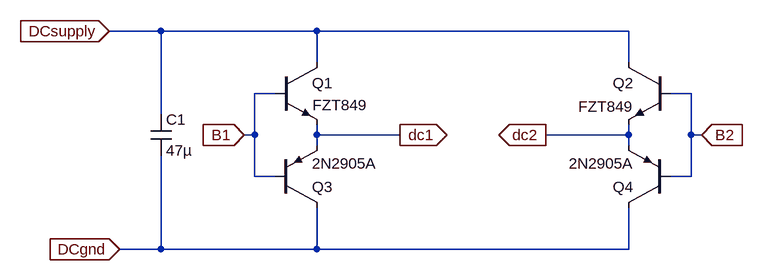
[diagram p0: schematic DCmotor_driver.asc]
DCmotor_driver.asc, the LTspice schematic file:
Version 4
SHEET 1 1004 680
WIRE 80 -32 0 -32
WIRE 320 -32 80 -32
WIRE 800 -32 320 -32
WIRE 320 16 320 -32
WIRE 800 16 800 -32
WIRE 256 64 224 64
WIRE 896 64 864 64
WIRE 80 96 80 -32
WIRE 224 128 224 64
WIRE 224 128 208 128
WIRE 320 128 320 112
WIRE 448 128 320 128
WIRE 800 128 800 112
WIRE 800 128 672 128
WIRE 896 128 896 64
WIRE 912 128 896 128
WIRE 320 144 320 128
WIRE 800 144 800 128
WIRE 224 192 224 128
WIRE 256 192 224 192
WIRE 896 192 896 128
WIRE 896 192 864 192
WIRE 80 304 80 160
WIRE 80 304 16 304
WIRE 320 304 320 240
WIRE 320 304 80 304
WIRE 800 304 800 240
WIRE 800 304 320 304
FLAG 0 -32 DCsupply
IOPIN 0 -32 In
FLAG 16 304 DCgnd
IOPIN 16 304 In
FLAG 208 128 B1
IOPIN 208 128 In
FLAG 448 128 dc1
IOPIN 448 128 Out
FLAG 912 128 B2
IOPIN 912 128 In
FLAG 672 128 dc2
IOPIN 672 128 Out
SYMBOL cap 64 96 R0
SYMATTR InstName C1
SYMATTR Value 47µ
SYMBOL npn 256 16 R0
WINDOW 3 57 66 Left 2
SYMATTR Value FZT849
SYMATTR InstName Q1
SYMBOL pnp 256 240 M180
SYMATTR InstName Q3
SYMATTR Value 2N2905A
SYMBOL npn 864 16 M0
SYMATTR InstName Q2
SYMATTR Value FZT849
SYMBOL pnp 864 240 R180
SYMATTR InstName Q4
SYMATTR Value 2N2905A

The netlist it stands for:
* DCmotor_driver.asc
C1 DCsupply DCgnd 47µ
Q1 DCsupply B1 dc1 0 FZT849
Q3 DCgnd B1 dc1 0 2N2905A
Q2 DCsupply B2 dc2 0 FZT849
Q4 DCgnd B2 dc2 0 2N2905A
.model NPN NPN
.model PNP PNP
.lib standard.bjt
.backanno
.end